# Altium schematic sheet Power.SchDoc: Система питания
size 420 x 297 mm; Author: DarkFox; CompanyName: Open Source; DocumentNumber: 2; SheetNumber: 2; SheetTotal: 3; PageSetup: Record=PageOptions|CenterHorizontal=True|CenterVertical=True|PrintScale=0.94|XCorrection=1.00|YCorrection=1.00|PrintKind=1|BorderSize=5000000|LeftOffset=0|BottomOffset=0|Orientation=1|PaperLength=1000|PaperWidth=1000|Scale=100|PaperSource=7|PrintQuality=-4|MediaType=1|DitherType=10|PaperKind=A4|PrintScaleMode=1; DecimalNumber: 2083.234267.003; Name: Система питания; DocumentName: Sheet1.SCHDOC
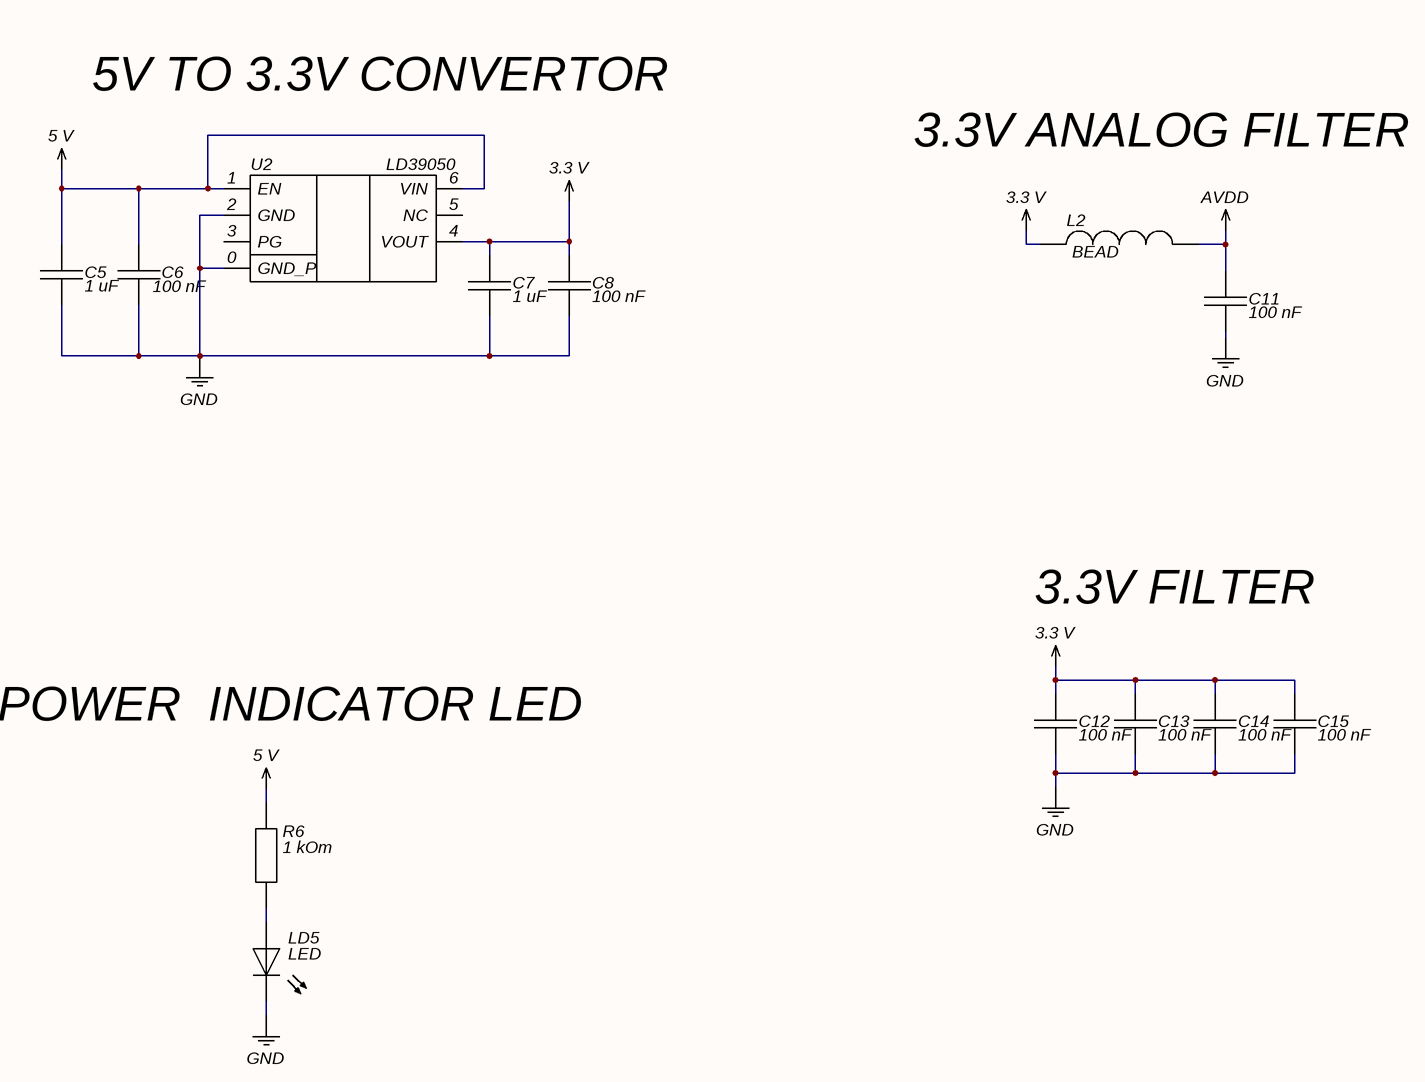
[diagram p0: Power.SchDoc]

## Parts
C5  1 uF  [0603]
C6  100 nF  [0603]
C7  1 uF  [0603]
C8  100 nF  [0603]
C11  100 nF  [0603]
C12  100 nF  [0603]
C13  100 nF  [0603]
C14  100 nF  [0603]
C15  100 nF  [0603]
L2  100 mH  [0603]  (value not drawn)
LD5  LED  [0603]
R6  1 kOm  [0603]
U2  LD39050  [DFN6]

## Nets
3.3 V: C7.1 C8.1 C12.2 C13.2 C14.2 C15.2 L2.1 U2.4(VOUT)
5 V: C5.1 C6.1 R6.2 U2.1(EN) U2.6(VIN)
AVDD: C11.2 L2.2
GND: C5.2 C6.2 C7.2 C8.2 C11.1 C12.1 C13.1 C14.1 C15.1 LD5.2 U2.0(GND_P) U2.2(GND)
NetLD5_1: LD5.1 R6.1

Not connected (* = marked no-connect by the designer): U2 3(PG) 5(NC)

## Notes on the sheet
- 5V TO 3.3V CONVERTOR
- 3.3V ANALOG FILTER
- (near L2) BEAD
- 3.3V FILTER
- POWER  INDICATOR LED
- Перв.примен.
- Справ.№
- Подп. и дата
- Инв.№ дубл.
- Взам.инв.№
- Подп.и дата
- Разраб.
- Изм.
- Лист
- № докум.
- Подп.
- Дата
- Лит.
- Масштаб
- Масса
- Т.контр.
- Пров.
- СХЕМА   ЭЛЕКТРИЧЕСКАЯ
- ПРИНЦИПИАЛЬНАЯ
- Листов
- Инв.№ подл.
- Утв.
- Н.контр.
- Нач.сект.

## Library data of the parts
C5-C8 C11-C15 = Cup
L2 = Inductor
R6 = Res
U2 = LD39050: voltage regulator